# EAGLE design Adafruit RP2040 Tester Brains rev A (EAGLE 9.6.2)
COMPANY: ADAFRUIT INDUSTRIES; DRAWN: KTOWN; REV: B
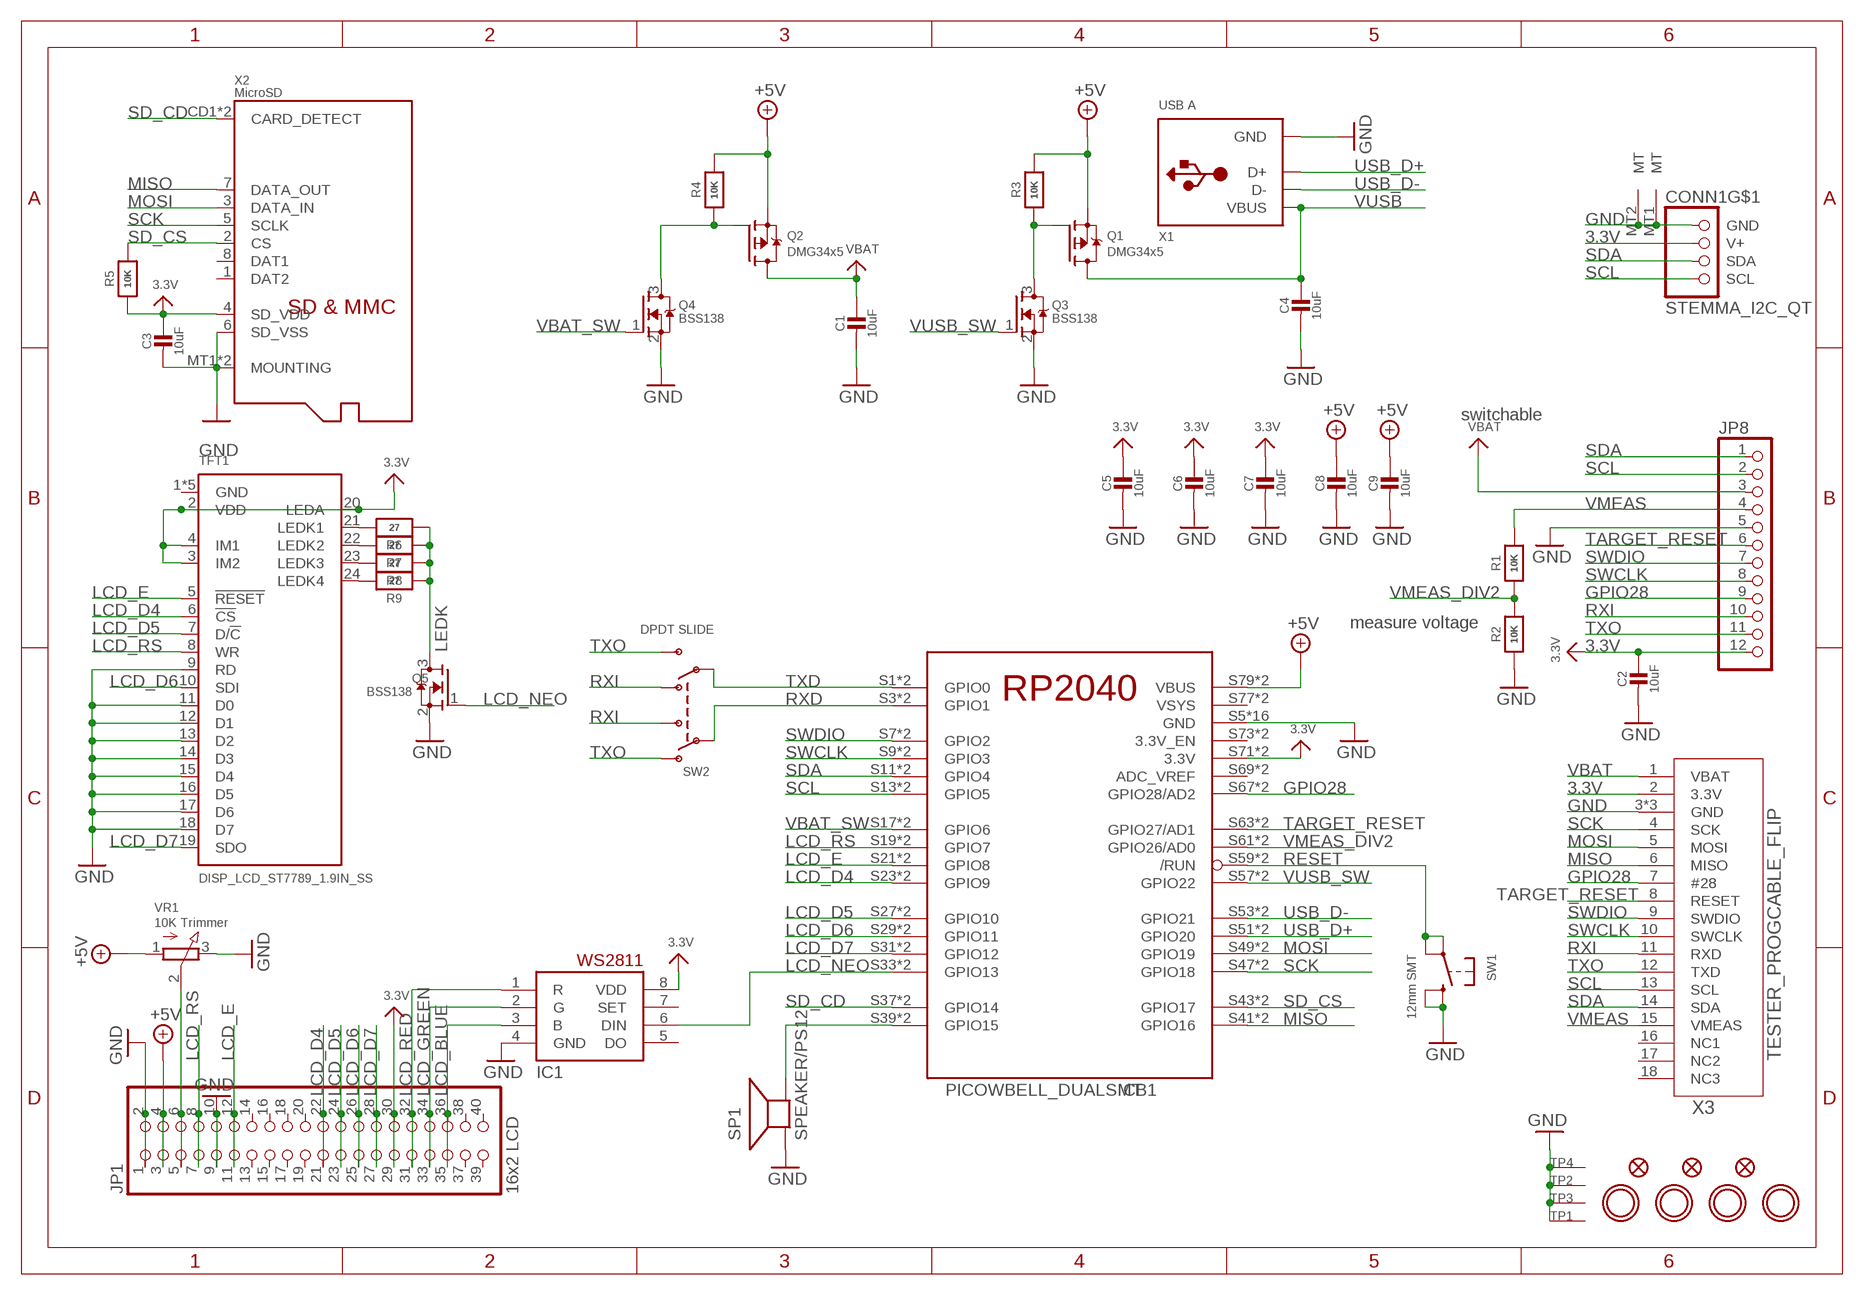
[diagram p0: schematic, sheet 1]

## Parts
C1  10uF  CAP_CERAMIC0805-NOOUTLINE  [0805-NO]
C2  10uF  CAP_CERAMIC0805-NOOUTLINE  [0805-NO]
C3  10uF  CAP_CERAMIC0805-NOOUTLINE  [0805-NO]
C4  10uF  CAP_CERAMIC0805-NOOUTLINE  [0805-NO]
C5  10uF  CAP_CERAMIC0805-NOOUTLINE  [0805-NO]
C6  10uF  CAP_CERAMIC0805-NOOUTLINE  [0805-NO]
C7  10uF  CAP_CERAMIC0805-NOOUTLINE  [0805-NO]
C8  10uF  CAP_CERAMIC0805-NOOUTLINE  [0805-NO]
C9  10uF  CAP_CERAMIC0805-NOOUTLINE  [0805-NO]
CB1  PICOWBELL_DUALSMT  [PICOWBELL_DUALSMT]
CONN1  STEMMA_I2C_QT  [JST_SH4]
FID1  FIDUCIAL_1MM  [FIDUCIAL_1MM]
FID2  FIDUCIAL_1MM  [FIDUCIAL_1MM]
FID3  FIDUCIAL_1MM  [FIDUCIAL_1MM]
IC1  WS2811-SOP8  [SO08-SKINNYPADS]
JP1  16x2 LCD  PINHD-2X20_SMT  [2X20_SMT_MALE]
JP8  HEADER-1X12OVAL  [1X12_OVAL]
Q1  DMG34x5  MOSFET-PWIDE  [SOT23-WIDE]
Q2  DMG34x5  MOSFET-PWIDE  [SOT23-WIDE]
Q3  BSS138  MOSFET-NWIDE  [SOT23-WIDE]
Q4  BSS138  MOSFET-NWIDE  [SOT23-WIDE]
Q5  BSS138  MOSFET-NWIDE  [SOT23-WIDE]
R1  10K  RESISTOR_0603_NOOUT  [0603-NO]
R2  10K  RESISTOR_0603_NOOUT  [0603-NO]
R3  10K  RESISTOR_0603_NOOUT  [0603-NO]
R4  10K  RESISTOR_0603_NOOUT  [0603-NO]
R5  10K  RESISTOR_0603_NOOUT  [0603-NO]
R6  27  RESISTOR_0603_NOOUT  [0603-NO]
R7  27  RESISTOR_0603_NOOUT  [0603-NO]
R8  27  RESISTOR_0603_NOOUT  [0603-NO]
R9  27  RESISTOR_0603_NOOUT  [0603-NO]
SP1  SPEAKER/PS12  [PS12]
SW1  12mm SMT  SWITCH_TACT_SMT_12MM  [B3F-40XX-SMT]
SW2  DPDT SLIDE  SWITCH_DPDTEG1390  [EG1390]
TFT1  DISP_LCD_ST7789_1.9IN_SS  [TFT_1.9IN_170X320_30P_SS]
TP1  SEWTAP_SMTNUTM3  [SMT_NUT_3MM]
TP2  SEWTAP_SMTNUTM3  [SMT_NUT_3MM]
TP3  SEWTAP_SMTNUTM3  [SMT_NUT_3MM]
TP4  SEWTAP_SMTNUTM3  [SMT_NUT_3MM]
U$7  MOUNTINGHOLE3.0THIN  [MOUNTINGHOLE_3.0_PLATEDTHIN]
U$8  MOUNTINGHOLE3.0THIN  [MOUNTINGHOLE_3.0_PLATEDTHIN]
U$9  MOUNTINGHOLE3.0THIN  [MOUNTINGHOLE_3.0_PLATEDTHIN]
U$10  MOUNTINGHOLE3.0THIN  [MOUNTINGHOLE_3.0_PLATEDTHIN]
VR1  10K Trimmer  TRIMPOTTC33X-2  [TRIMPOT_BOURNS_TC33X-2]
X1  USB A  USB_TYPEA_SMT  [USB_HOST-SMT]
X2  MicroSD  MICROSD  [MICROSD]
X3  TESTER_PROGCABLE_FLIP  [FPC_0.5MM_18PIN]

## Nets
3.3V: C2.1 C3.1 C5.1 C6.1 C7.1 CB1.S71(3.3V) CB1.S72(3.3V) CONN1.2(V+) IC1.8(VDD) JP1.29 JP1.30 JP8.12 R5.1 TFT1.2(VDD) TFT1.3(IM2) TFT1.4(IM1) TFT1.20(LEDA) X2.4(SD_VDD) X3.2(3.3V)
!VBAT_SW1: Q2.1(G) Q4.3(D) R4.1
!VBAT_SW2: Q1.1(G) Q3.3(D) R3.1
+5V: C8.1 C9.1 CB1.S79(VBUS) CB1.S80(VBUS) JP1.3 JP1.4 Q1.2(S) Q2.2(S) R3.2 R4.2 VR1.1(A)
GND: C1.2 C2.2 C3.2 C4.2 C5.2 C6.2 C7.2 C8.2 C9.2 CB1.S5(GND) CB1.S6(GND) CB1.S15(GND) CB1.S16(GND) CB1.S25(GND) CB1.S26(GND) CB1.S35(GND) CB1.S36(GND) CB1.S45(GND) CB1.S46(GND) CB1.S55(GND) CB1.S56(GND) CB1.S65(GND) CB1.S66(GND) CB1.S75(GND) CB1.S76(GND) CONN1.1(GND) CONN1.MT1(MT) CONN1.MT2(MT) IC1.4(GND) JP1.1 JP1.2 JP1.9 JP1.10 JP8.5 Q3.2(S) Q4.2(S) Q5.2(S) R2.1 SP1.P$1(+) SW1.P$3(S) SW1.P$4(S1) TFT1.9(RD) TFT1.11(D0) TFT1.12(D1) TFT1.13(D2) TFT1.14(D3) TFT1.15(D4) TFT1.16(D5) TFT1.17(D6) TFT1.18(D7) TP1.P$1(SEW) TP2.P$1(SEW) TP3.P$1(SEW) TP4.P$1(SEW) VR1.3(E) X1.GND X2.6(SD_VSS) X2.MT1(MOUNTING) X2.MT2(MOUNTING) X3.3(GND) X3.SUPPORT1(GND) X3.SUPPORT2(GND)
GPIO28: CB1.S67(GPIO28/AD2) CB1.S68(GPIO28/AD2) JP8.9 X3.7(#28)
LCD_BLUE: IC1.3(B) JP1.35 JP1.36
LCD_D4: CB1.S23(GPIO9) CB1.S24(GPIO9) JP1.21 JP1.22 TFT1.6(!CS)
LCD_D5: CB1.S27(GPIO10) CB1.S28(GPIO10) JP1.23 JP1.24 TFT1.7(D/!C)
LCD_D6: CB1.S29(GPIO11) CB1.S30(GPIO11) JP1.25 JP1.26 TFT1.10(SDI)
LCD_D7: CB1.S31(GPIO12) CB1.S32(GPIO12) JP1.27 JP1.28 TFT1.19(SDO)
LCD_E: CB1.S21(GPIO8) CB1.S22(GPIO8) JP1.11 JP1.12 TFT1.5(!RESET)
LCD_GREEN: IC1.2(G) JP1.33 JP1.34
LCD_NEO: CB1.S33(GPIO13) CB1.S34(GPIO13) IC1.6(DIN) Q5.1(G)
LCD_RED: IC1.1(R) JP1.31 JP1.32
LCD_RS: CB1.S19(GPIO7) CB1.S20(GPIO7) JP1.7 JP1.8 TFT1.8(WR)
LEDK: Q5.3(D) R6.1 R7.1 R8.1 R9.1
MISO: CB1.S41(GPIO16) CB1.S42(GPIO16) X2.7(DATA_OUT) X3.6(MISO)
MOSI: CB1.S49(GPIO19) CB1.S50(GPIO19) X2.3(DATA_IN) X3.5(MOSI)
N$1: CB1.S39(GPIO15) CB1.S40(GPIO15) SP1.P$2(-)
N$2: R6.2 TFT1.21(LEDK1)
N$3: R7.2 TFT1.22(LEDK2)
N$4: R8.2 TFT1.23(LEDK3)
N$5: R9.2 TFT1.24(LEDK4)
N$6: JP1.5 JP1.6 VR1.2(S)
RESET: CB1.S59(/RUN) CB1.S60(/RUN) SW1.P$1(P) SW1.P$2(P1)
RXD: CB1.S3(GPIO1) CB1.S4(GPIO1) SW2.P1
RXI: JP8.10 SW2.O2 SW2.S1 X3.11(RXD)
SCK: CB1.S47(GPIO18) CB1.S48(GPIO18) X2.5(SCLK) X3.4(SCK)
SCL: CB1.S13(GPIO5) CB1.S14(GPIO5) CONN1.4(SCL) JP8.2 X3.13(SCL)
SD_CD: CB1.S37(GPIO14) CB1.S38(GPIO14) X2.CD1(CARD_DETECT) X2.CD2(CARD_DETECT)
SD_CS: CB1.S43(GPIO17) CB1.S44(GPIO17) R5.2 X2.2(CS)
SDA: CB1.S11(GPIO4) CB1.S12(GPIO4) CONN1.3(SDA) JP8.1 X3.14(SDA)
SWCLK: CB1.S9(GPIO3) CB1.S10(GPIO3) JP8.8 X3.10(SWCLK)
SWDIO: CB1.S7(GPIO2) CB1.S8(GPIO2) JP8.7 X3.9(SWDIO)
TARGET_RESET: CB1.S63(GPIO27/AD1) CB1.S64(GPIO27/AD1) JP8.6 X3.8(RESET)
TXD: CB1.S1(GPIO0) CB1.S2(GPIO0) SW2.P2
TXO: JP8.11 SW2.O1 SW2.S2 X3.12(TXD)
USB_D+: CB1.S51(GPIO20) CB1.S52(GPIO20) X1.D+
USB_D-: CB1.S53(GPIO21) CB1.S54(GPIO21) X1.D-
VBAT: C1.1 JP8.3 Q2.3(D) X3.1(VBAT)
VBAT_SW: CB1.S17(GPIO6) CB1.S18(GPIO6) Q4.1(G)
VMEAS: JP8.4 R1.2 X3.15(VMEAS)
VMEAS_DIV2: CB1.S61(GPIO26/AD0) CB1.S62(GPIO26/AD0) R1.1 R2.2
VUSB: C4.1 Q1.3(D) X1.VBUS
VUSB_SW: CB1.S57(GPIO22) CB1.S58(GPIO22) Q3.1(G)
Unconnected: CB1.S69(ADC_VREF) CB1.S70(ADC_VREF) CB1.S73(3.3V_EN) CB1.S74(3.3V_EN) IC1.5(DO) IC1.7(SET) JP1.13 JP1.14 JP1.15 JP1.16 JP1.17 JP1.18 JP1.19 JP1.20 JP1.37 JP1.38 JP1.39 JP1.40 X2.1(DAT2) X2.8(DAT1) X3.16(NC1) X3.17(NC2) X3.18(NC3)

## Notes on the sheet
- switchable
- measure voltage

## Power pins joined to a net without a drawn wire
GND: TFT1.1(GND) TFT1.25(GND) TFT1.30(GND) TFT1.MNT1(GND) TFT1.MNT2(GND)
VSYS: CB1.S77(VSYS) CB1.S78(VSYS)

## Library data of the parts
C1-C9 = microbuilder:CAP_CERAMIC: Ceramic Capacitors For new designs, use the packages preceded by an '_' character since they are more reliable: The following footprints should be used on most boards: _0402 - Standard footprint for regular board layouts _0603 - Standard footprint for regular board layouts _0805 - Standard footprint for regular board layouts _1206 - Standard footprint for regular board layouts For extremely tight-pitch boards where space is at a premium, the following 'micro-pitch' footprints can be used (smaller pads, no silkscreen outline, etc.): _0402MP - Micro-pitch footprint for very dense/compact boards _0603MP - Micro-pitch footprint for very dense/compact boards _0805MP - Micro-pitch footprint for very dense/compact boards _1206MP - Micro-pitch footprint for very dense/compact boards
CB1 = adafruit_micro:PICOWBELL
CONN1 = adafruit_electromech:STEMMA_I2C; LCSC: C2845363
FID1-FID3 = microbuilder:FIDUCIAL: Fiducial Alignment Points Various fiducial points for machine vision alignment.; BOM: EXCLUDE
IC1 = adafruit:WS2811
JP1 = adafruit_electromech:PINHD-2X20: PIN HEADER
JP8 = microbuilder:HEADER-1X12
Q1 Q2 = microbuilder:MOSFET-P: P-Channel Mosfet LEGEND VDS: Voltage Drain-Source ID: Drain Current RDS(ON): Drain-Source On-State Resistance VGS(TH): Gate-Source Threshold Voltage CISS: Drain-Source Input Capacitance SOT-23 Name VDS ID RDS(ON) VGS(TH) CISS Order Number IRLML5103 30V 760mA 600 mOhm -- 75pF @ 25V Digikey: IRLML5103PBFCT-ND IRLML6401 12V 4.3A 50 mOhm 950mV @ 250µA 830pF @ 10V Digikey: IRLML6401PBFTR-ND NTR0202PL 20V 400mA 800 mOhm 2.3V @ 250uA 70pF @ 5V Digikey: NTR0202PLT1GOSTR-ND NTR4101PT1G 20V 1.8A 85 mOhm 1.2V @ 250uA 675pF @ 10V Digikey: NTR4101PT1GOSCT-ND DMP2004K 20V 600mA 900 mOhm 1V @ 250uA 175pF @ 16V Digikey: DMP2004KDICT-ND PMV65XP 20V 3.9A 76 mOhm 950mV @ 1mA 725pF @ 20V Digikey: 568-2358-2-ND TO-252 Name VDS ID RDS(ON) VGS(TH) CISS Order Number AOD417 30V 25A 34 mOhm 3V @ 250µA 920pF @ 15V Digikey: 785-1106-2-ND PowerPak Name VDS ID RDS(ON) VGS(TH) CISS Order Number AON7401 30V 12A 14 mOhm 3V @ 250µA 2600pF @ 15V Digikey: 785-1302-1-ND
Q3-Q5 = microbuilder:MOSFET-N: N-Channel Mosfet LEGEND VDS: Voltage Drain-Source ID: Drain Current RDS(ON): Drain-Source On-State Resistance VGS(TH): Gate-Source Threshold Voltage CISS: Drain-Source Input Capacitance SOT-23 Name VDS ID RDS(ON) VGS(TH) CISS Order Number 2N7002E 60V 260mA 2.5 Ohm 2.5V @ 250uA 26.7pF @ 25V 2N7002ET1GOSTR-ND BSH103 30V 850mA 400 mOhm 400mV @ 1mA 83pF @ 24V BSH103,235-ND BSS138 60V 320mA 1.6 Ohm 1.5V @ 250uA 50pF @ 10V Mouser: 771-BSS138PW115 DMN2075U-7 20V 4.2A 38 mOhm 1V @ 250 uA 594.3pF @ 10V DMN2075U-7DICT-ND * BSS138 good choice for I2C level-shifting POWERPAK 1212-8 Name VDS ID RDS(ON) VGS(TH) CISS Order Number Si7308DN 60V 6A 58 mOhm 3V @ 250uA 665pF @ 15V SI7308DN-T1-E3CT-ND
R1-R5 = microbuilder:RESISTOR: Resistors For new designs, use the packages preceded by an '_' character since they are more reliable: The following footprints should be used on most boards: _0402 - Standard footprint for regular board layouts _0603 - Standard footprint for regular board layouts _0805 - Standard footprint for regular board layouts _1206 - Standard footprint for regular board layouts For extremely tight-pitch boards where space is at a premium, the following 'micro-pitch' footprints can be used (smaller pads, no silkscreen outline, etc.): _0402MP - Micro-pitch footprint for very dense/compact boards _0603MP - Micro-pitch footprint for very dense/compact boards _0805MP - Micro-pitch footprint for very dense/compact boards _1206MP - Micro-pitch footprint for very dense/compact boards
R6-R9 = microbuilder:RESISTOR: Resistors For new designs, use the packages preceded by an '_' character since they are more reliable: The following footprints should be used on most boards: _0402 - Standard footprint for regular board layouts _0603 - Standard footprint for regular board layouts _0805 - Standard footprint for regular board layouts _1206 - Standard footprint for regular board layouts For extremely tight-pitch boards where space is at a premium, the following 'micro-pitch' footprints can be used (smaller pads, no silkscreen outline, etc.): _0402MP - Micro-pitch footprint for very dense/compact boards _0603MP - Micro-pitch footprint for very dense/compact boards _0805MP - Micro-pitch footprint for very dense/compact boards _1206MP - Micro-pitch footprint for very dense/compact boards; LCSC: C25190
SP1 = microbuilder:SPEAKER: SPEAKER Source: Buerklin Added PS12 (for part # PS1240 piezo) http://www.ladyada.net/library/pcb/eaglelibrary.html
SW1 = adafruit_electromech:SWITCH_TACT_SMT: SMT Tact Switches 6x6mm - Digikey: P12940SCT-ND KMR2 (4.6x2.8mm) - Digikey: 401-1426-1-ND EVQ-PQHB55 - Light Touch, 160GF (4.5x4.5mm) - Digikey: P8090SCT-ND KMT0 - KMT021 NGJ LHS (etc.) IP68/Waterproof - Digikey: CKN10289CT-ND
SW2 = adafruit_electromech:SWITCH_DPDT: Switch - DPDT A DPDT Switch acts like an SPDT switch, but has a pair of switches instead of just one. Vertical - 0.3A @ 6V SMT - Digikey: JS202011SCQN; LCSC: C318999
TFT1 = adafruit_display:DISP_LCD_ST7789_1.9IN
TP1-TP4 = adafruit_electromech:SEWTAP
U$7-U$10 = adafruit_electromech:MOUNTINGHOLE: Mounting Hole For #2 screws (0.086"/2.18mm width, 0.094"/2.4mm hole) use 2.5mm; BOM: EXCLUDE
VR1 = microbuilder:TRIMPOT: 3-Pin SMT Trimpots Bourns TC33 (X-2) Series 1K - Digikey: TC33X-102ECT-ND 10K - Digikey: TC33X-2-103E 100K - Digikey: TC33X-104ECT-ND Bourns 3303 (W) Series 3mm 10K Single Turn - Digikey: 3303W-103ETR-ND 3mm 100K Single Turn - Digikey: 3303X-104ETR-ND; ROT: 270
X1 = adafruit_electromech:USB_TYPEA: USB - Type A Connectors Male types stick out and are inserted into a PC or matching females parts (these are the connectors used on USB Memory Sticks, etc.). Female parts are generally used for USB Host and accept a male-type connector. SMT - 4UCON: 10017 PTHFML - Digikey: 609-1045-ND, 4UCon: 05241 PCB - Use 2.0mm thick PCBs with this footprint
X2 = adafruit_electromech:MICROSD: MicroSD/Transflash Card Holder with SPI pinout 3M: 2908-05WB-MG 4UConnector: 19656 Footprint courtesy: Adafruit Industries; JLC_ROTATION: 90; LCSC: C125617
X3 = adafruit_electromech:TESTER_PROGCABLE; LCSC: C2856802

## Net classes
1 power: width 0.254 mm

## Board
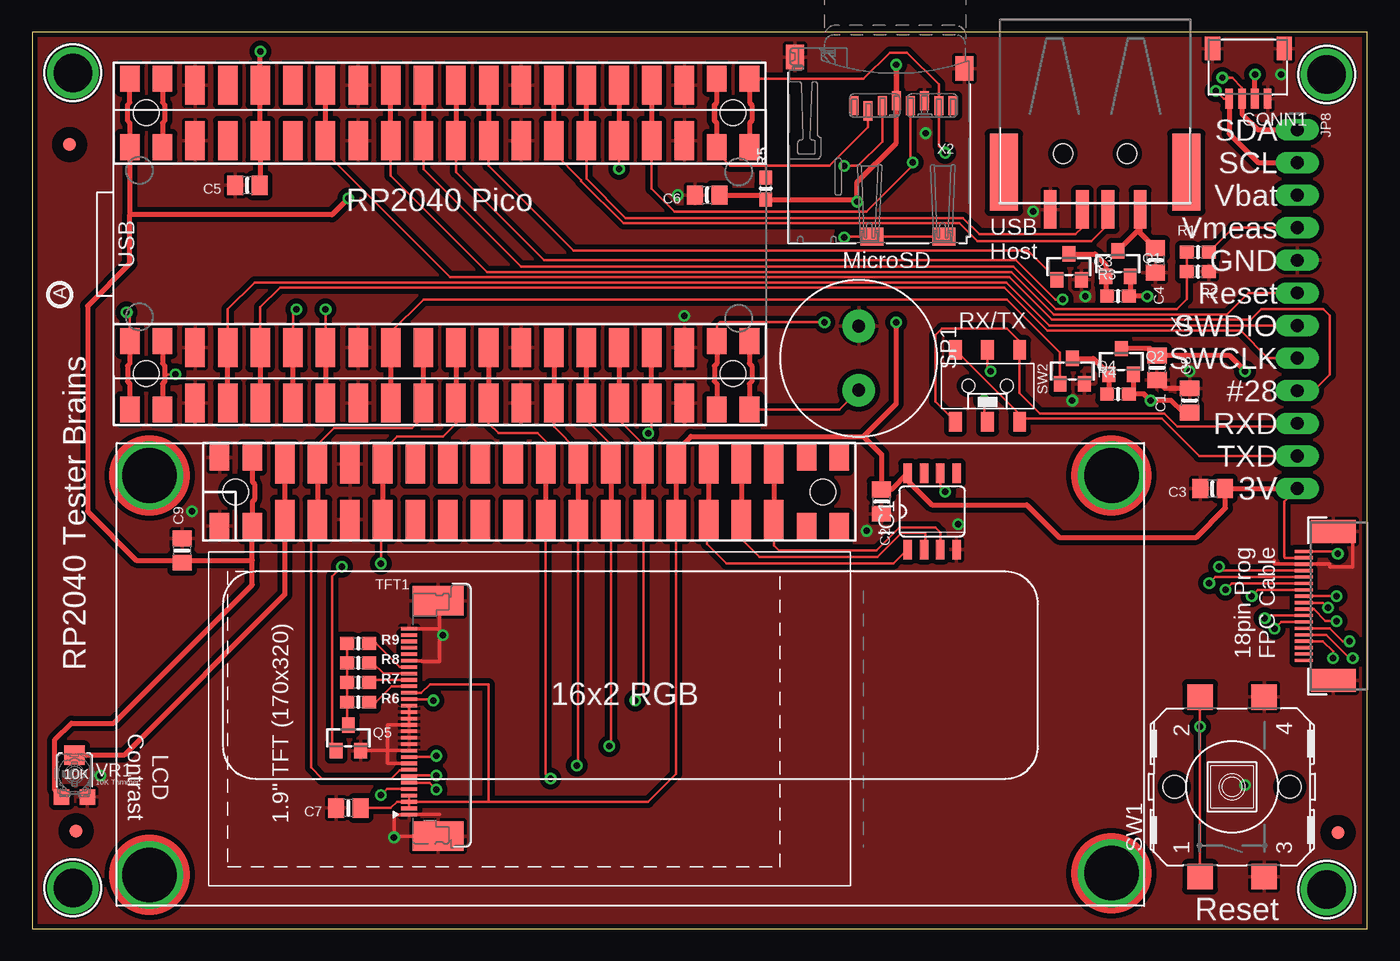
[diagram p1: board, top side]
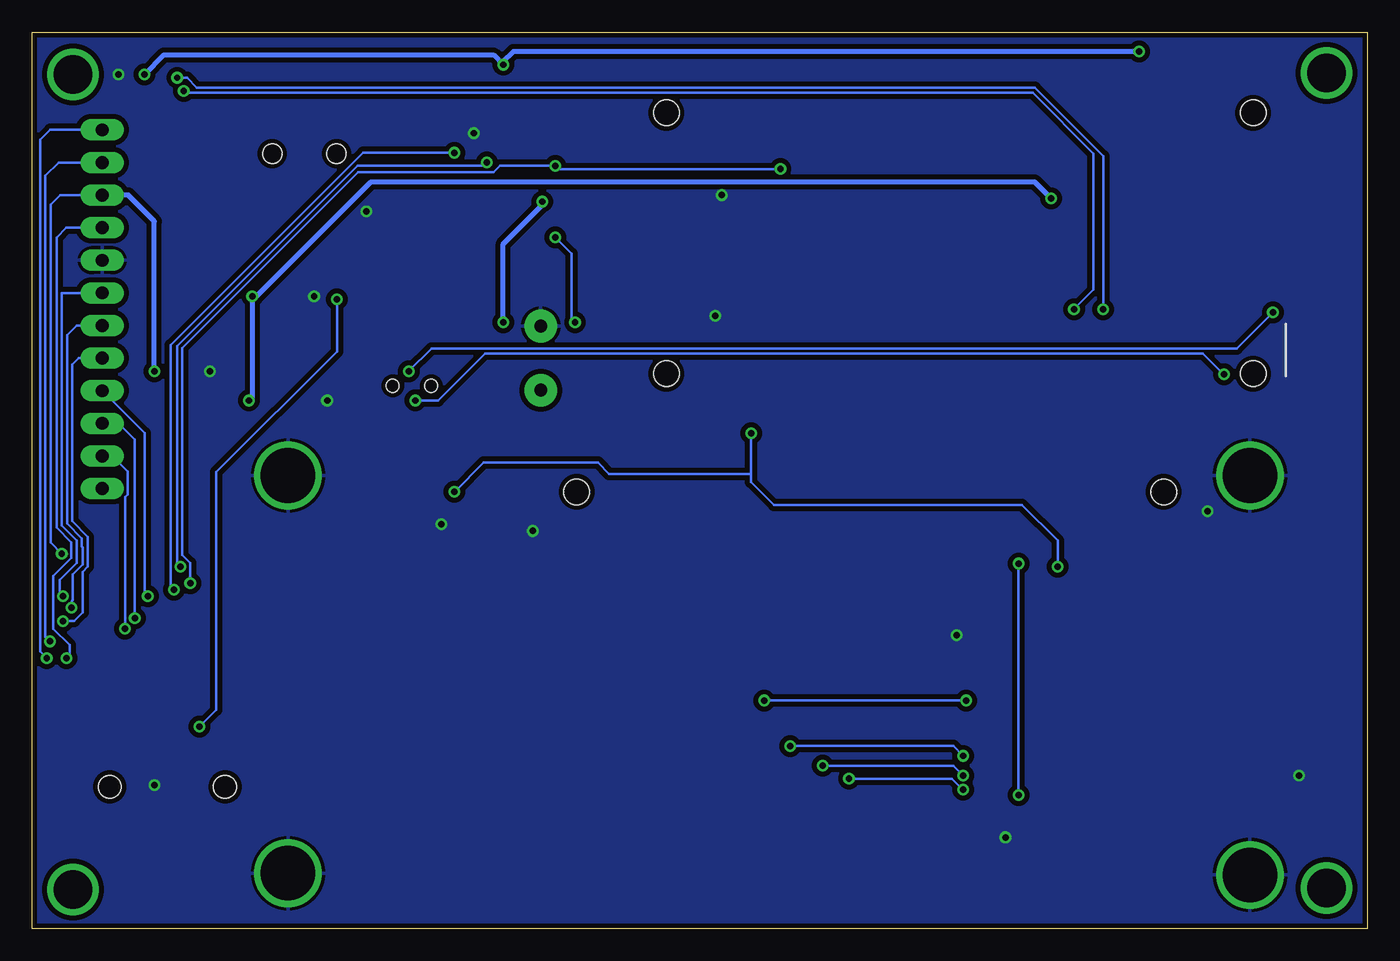
[diagram p2: board, bottom side, seen from below]

Size 104.01 x 69.85 mm. Coordinates in mm from the lower left corner, seen from the top.
Outline: 0,69.85 0,0 104.01,0 104.01,69.85 0,69.85
Copper layers (1*16): Top 0.035mm / dielectric 1.5mm / Bottom 0.035mm
Design rules "adafruit 8-8": minimum track width 6mil, minimum drill 15.5mil, track to track 8mil, track to pad 8mil, pad to pad 8mil, via to via 8mil, smd to smd 8mil, copper to edge 10mil, drill to drill 8mil, minimum pad ring 10mil, minimum via ring 8mil, stop-mask expansion 2mil, vias tented up to drill 20mil, thermal gap 10mil

### Footprints (pad centres in the part's own frame; a part is rotated, then mirrored left to right if it is on the bottom)
0805-NO = smd 1.24 x 1.5: 1 -0.95,0; 2 0.95,0
PICOWBELL_DUALSMT = smd 1.524 x 2.032: S1 -24.13,-12.889; S2 -24.13,-7.555; S3 -21.59,-12.889; S4 -21.59,-7.555; S37 21.59,-12.889; S38 21.59,-7.555; S39 24.13,-12.889; S40 24.13,-7.555; S41 24.13,12.889; S42 24.13,7.555; S43 21.59,12.889; S44 21.59,7.555; S77 -21.59,7.555; S78 -21.59,12.889; S79 -24.13,7.555; S80 -24.13,12.889 | smd 1.524 x 3.048: S5 -19.05,-12.381; S6 -19.05,-8.063; S7 -16.51,-12.381; S8 -16.51,-8.063; S9 -13.97,-12.381; S10 -13.97,-8.063; S11 -11.43,-12.381; S12 -11.43,-8.063; S13 -8.89,-12.381; S14 -8.89,-8.063; S15 -6.35,-12.381; S16 -6.35,-8.063; S17 -3.81,-12.381; S18 -3.81,-8.063; S19 -1.27,-12.381; S20 -1.27,-8.063; S21 1.27,-12.381; S22 1.27,-8.063; S23 3.81,-12.381; S24 3.81,-8.063; S25 6.35,-12.381; S26 6.35,-8.063; S27 8.89,-12.381; S28 8.89,-8.063; S29 11.43,-12.381; S30 11.43,-8.063; S31 13.97,-12.381; S32 13.97,-8.063; S33 16.51,-12.381; S34 16.51,-8.063; S35 19.05,-12.381; S36 19.05,-8.063; S45 19.05,8.063; S46 19.05,12.381; S47 16.51,8.063; S48 16.51,12.381; S49 13.97,8.063; S50 13.97,12.381; S51 11.43,8.063; S52 11.43,12.381; S53 8.89,8.063; S54 8.89,12.381; S55 6.35,8.063; S56 6.35,12.381; S57 3.81,8.063; S58 3.81,12.381; S59 1.27,8.063; S60 1.27,12.381; S61 -1.27,8.063; S62 -1.27,12.381; S63 -3.81,8.063; S64 -3.81,12.381; S65 -6.35,8.063; S66 -6.35,12.381; S67 -8.89,8.063; S68 -8.89,12.381; S69 -11.43,8.063; S70 -11.43,12.381; S71 -13.97,8.063; S72 -13.97,12.381; S73 -16.51,8.063; S74 -16.51,12.381; S75 -19.05,8.063; S76 -19.05,12.381 | hole 2: -22.86,10.222; 22.86,10.222; 22.86,-10.098; -22.86,-10.098
JST_SH4 = smd 0.6 x 1.55: 1 -1.5,2.006; 2 -0.5,2.006; 3 0.5,2.006; 4 1.5,2.006 | smd 1.2 x 1.8: MT1 -2.8,-1.894; MT2 2.8,-1.894
FIDUCIAL_1MM = smd 1 x 1: 1 0,0
SO08-SKINNYPADS = smd 0.66 x 1.524: 1 -1.905,-2.973; 2 -0.635,-2.973; 3 0.635,-2.973; 4 1.905,-2.973; 5 1.905,2.973; 6 0.635,2.973; 7 -0.635,2.973; 8 -1.905,2.973
2X20_SMT_MALE = smd 1.524 x 2.032: 1 -24.13,-2.667; 2 -24.13,2.667; 3 -21.59,-2.667; 4 -21.59,2.667; 37 21.59,-2.667; 38 21.59,2.667; 39 24.13,-2.667; 40 24.13,2.667 | smd 1.524 x 3.048: 5 -19.05,-2.159; 6 -19.05,2.159; 7 -16.51,-2.159; 8 -16.51,2.159; 9 -13.97,-2.159; 10 -13.97,2.159; 11 -11.43,-2.159; 12 -11.43,2.159; 13 -8.89,-2.159; 14 -8.89,2.159; 15 -6.35,-2.159; 16 -6.35,2.159; 17 -3.81,-2.159; 18 -3.81,2.159; 19 -1.27,-2.159; 20 -1.27,2.159; 21 1.27,-2.159; 22 1.27,2.159; 23 3.81,-2.159; 24 3.81,2.159; 25 6.35,-2.159; 26 6.35,2.159; 27 8.89,-2.159; 28 8.89,2.159; 29 11.43,-2.159; 30 11.43,2.159; 31 13.97,-2.159; 32 13.97,2.159; 33 16.51,-2.159; 34 16.51,2.159; 35 19.05,-2.159; 36 19.05,2.159 | hole 2: -22.86,0; 22.86,0
1X12_OVAL = drill 1 pad 1.676 long: 1 -13.97,0; 2 -11.43,0; 3 -8.89,0; 4 -6.35,0; 5 -3.81,0; 6 -1.27,0; 7 1.27,0; 8 3.81,0; 9 6.35,0; 10 8.89,0; 11 11.43,0; 12 13.97,0
SOT23-WIDE = smd 1 x 1.2: 1 -0.95,-1; 2 0.95,-1; 3 0,1
0603-NO = smd 1.075 x 1: 1 -0.85,0; 2 0.85,0
PS12 = drill 1 pad 2.54: P$1 -2.5,0; P$2 2.5,0
B3F-40XX-SMT = smd 2 x 2: P$1 -7,2.5; P$2 7,2.5; P$3 -7,-2.5; P$4 7,-2.5 | hole 1.803: 0,-4.496; 0,4.496
EG1390 = smd 1 x 1.5: O1 -2.5,2.8; O2 -2.5,-2.8; P1 0,2.8; P2 0,-2.8; S1 2.5,2.8; S2 2.5,-2.8 | hole 1: 1.5,0; -1.5,0
TFT_1.9IN_170X320_30P_SS = smd 0.28 x 1.25: 1 -7.25,1.236; 2 -6.75,1.236; 3 -6.25,1.236; 4 -5.75,1.236; 5 -5.25,1.236; 6 -4.75,1.236; 7 -4.25,1.236; 8 -3.75,1.236; 9 -3.25,1.236; 10 -2.75,1.236; 11 -2.25,1.236; 12 -1.75,1.236; 13 -1.25,1.236; 14 -0.75,1.236; 15 -0.25,1.236; 16 0.25,1.236; 17 0.75,1.236; 18 1.25,1.236; 19 1.75,1.236; 20 2.25,1.236; 21 2.75,1.236; 22 3.25,1.236; 23 3.75,1.236; 24 4.25,1.236; 25 4.75,1.236; 26 5.25,1.236; 27 5.75,1.236; 28 6.25,1.236; 29 6.75,1.236; 30 7.25,1.236 | smd 2.3 x 4: MNT1 -8.92,-1.02; MNT2 9.42,-1.02
SMT_NUT_3MM = drill 4.25 pad 4.572: P$1 0,0
MOUNTINGHOLE_3.0_PLATEDTHIN = drill 3 pad 3.6: P$1 0,0
TRIMPOT_BOURNS_TC33X-2 = smd 1.2 x 1.2: 1 -1,-1.8; 3 1,-1.8 | smd 1.6 x 1.5: 2 0,1.45
USB_HOST-SMT = smd 1 x 3: D+ 1,0.495; D- -1,0.495; GND 3.5,0.495; VBUS -3.5,0.495 | smd 2.2 x 6: MT1 -7.1,-2.413; MT2 7.1,-2.413 | hole 1.5: -2.5,-3.863; 2.5,-3.863
MICROSD = smd 0.7 x 1.5: 1 1.761,-3.147; 2 0.661,-2.747; 3 -0.439,-3.147; 4 -1.539,-3.547; 5 -2.639,-3.147; 6 -3.739,-3.547; 7 -4.839,-3.147; 8 -5.939,-3.147 | smd 1.8 x 1.4: CD1 -5.239,7.053; CD2 0.38,7.053 | smd 1.4 x 1.9: MT1 -6.839,-6.047; MT2 6.361,-6.947
FPC_0.5MM_18PIN = smd 0.25 x 1.4: 1 4.25,1.154; 2 3.75,1.154; 3 3.25,1.154; 4 2.75,1.154; 5 2.25,1.154; 6 1.75,1.154; 7 1.25,1.154; 8 0.75,1.154; 9 0.25,1.154; 10 -0.25,1.154; 11 -0.75,1.154; 12 -1.25,1.154; 13 -1.75,1.154; 14 -2.25,1.154; 15 -2.75,1.154; 16 -3.25,1.154; 17 -3.75,1.154; 18 -4.25,1.154 | smd 1.8 x 3.5: SUPPORT1 -5.8,-1.152; SUPPORT2 5.8,-1.152

### Placement (x,y rotation side)
C1  87.63,43.69 270 top
C2  66.17,33.27 270 top
C3  91.95,34.29 180 top
C4  87.5,52.07 270 top
C5  16.76,57.91 180 top
C6  52.58,57.15 180 top
C7  24.64,9.4 180 top
C8  90.17,41.15 90 top
C9  11.68,29.46 90 top
CB1  31.75,53.34 0 top
CONN1  94.74,66.67 180 top
FID1  3.43,7.62 0 top
FID2  2.92,61.09 0 top
FID3  101.73,7.49 0 top
IC1  70.1,32.51 0 top
JP1  38.73,34.04 0 top
JP8  98.55,48.26 270 top
Q1  84.58,51.82 0 top
Q2  84.84,44.2 0 top
Q3  80.77,51.56 0 top
Q4  81.03,43.43 0 top
Q5  24.64,14.86 0 top
R1  90.81,52.7 0 top
R2  90.81,51.18 180 top
R3  84.58,49.28 0 top
R4  84.58,41.66 0 top
R5  57.15,57.66 90 top
R6  25.4,17.65 0 top
R7  25.4,19.18 0 top
R8  25.4,20.7 0 top
R9  25.4,22.23 0 top
SP1  64.39,44.45 270 top
SW1  93.47,11.05 90 top
SW2  74.42,42.29 180 top
TFT1  30.61,16.13 90 top
TP1  9.14,4.19 0 top
TP2  9.14,35.31 0 top
TP3  84.07,35.31 0 top
TP4  84.07,4.32 0 top
U$7  100.84,66.55 0 top
U$8  3.17,66.67 0 top
U$9  3.17,3.17 0 top
U$10  100.84,3.05 0 top
U$13  [PCBFEAT-REV-040]  2.16,49.4 90 top
VR1  3.3,12.06 0 top
X1  82.8,56.52 180 top
X2  65.79,60.96 180 top
X3  100.2,25.15 90 top

### Tracks (layer width: path | path; a pad name or v marks a point on that pad's centre or on a via)
3.3V  (via drill 0.5)
  Top 0.203: JP1.29 50.16,12.06 47.98,9.88 35.56,9.88 | 35.56,9.88 29.42,9.88 29.37,9.94 TFT1.4 TFT1.3 | TFT1.3 29.46,9.88 29.37,9.97 | TFT1.3 TFT1.2 | TFT1.20 30.32,18.38 30.99,19.05 35.56,19.05 35.56,9.88 | X3.2 97.6,28.9 97.54,28.96 97.54,33.27 JP8.12 | TFT1.3 28.42,9.88 27.94,9.4 C7.1
  Top 0.406: CONN1.2 v95.24,66.54 v95.25,66.55 | X2.4 67.31,64.52 v67.31,67.31 67.31,61.21 64.26,58.17 v64.26,56.64 64.26,56.81 R5.1 56.81,57.15 C6.1 | JP1.29 JP1.30 50.16,37.21 51.31,38.35 64.77,38.35 | 64.77,38.35 66.17,36.96 C2.1 66.94,34.22 IC1.8 68.2,34.92 70.1,33.02 77.47,33.02 80.01,30.48 90.68,30.48 92.96,32.77 92.96,34.29 | C3.1 92.96,34.29 | 92.96,34.29 JP8.12 | v17.78,68.33 CB1.S72 CB1.S71 17.78,57.98 C5.1 | v17.78,68.33 | 64.77,38.35 67.31,40.89 v67.31,47.24
  Bottom 0.406: v95.25,66.55 93.73,68.07 68.07,68.07 v67.31,67.31 67.31,67.56 66.55,68.33 v17.78,68.33 | v67.31,47.24 67.31,53.34 64.26,56.39 v64.26,56.64
!VBAT_SW1
  Top 0.406: R4.1 83.89,41.81 Q2.1 82.65,44.43 Q4.3
!VBAT_SW2
  Top 0.406: R3.1 83.63,49.38 Q1.1 83.63,51.75 82.82,52.56 Q3.3
+5V  (via drill 0.5)
  Top 0.406: CB1.S80 7.62,64.35 7.43,64.17 7.43,62.96 7.62,62.77 CB1.S79 7.62,55.63 | Q1.2 85.53,49.38 R3.2 v86.87,49.28 | Q2.2 85.79,42.01 R4.2 86.61,41.66 v87.12,41.15 88.71,41.15 89.66,40.2 C8.1 | JP1.4 17.14,34.83 17.33,34.64 17.33,33.43 17.14,33.24 JP1.3 17.14,28.7 | VR1.1 1.78,10.79 1.78,14.73 3.05,16 6.35,16 17.14,26.8 17.14,28.7 | 7.62,55.63 7.62,51.82 4.32,48.51 4.32,32.51 8.13,28.7 11.36,28.7 | 11.36,28.7 17.14,28.7 | v24.64,56.9 23.37,55.63 7.62,55.63 | C9.1 11.36,28.7
  Bottom 0.406: v24.64,56.9 25.91,58.17 77.63,58.17 86.52,49.28 v86.87,49.28 86.87,41.4 v87.12,41.15
GND  (via drill 0.5)
  Top 0.203: TFT1.18 TFT1.17 TFT1.16 TFT1.15
  Top 0.254: TFT1.11 27.69,13.88 | 27.69,13.88 25.59,13.88 Q5.2 | TFT1.9 27.69,12.88 27.69,13.88 | TFT1.15 27.69,15.88 27.69,13.88 | TFT1.30 29.37,23.37 31.75,23.37 | 31.75,23.37 31.75,25.55 TFT1.MNT2 | TFT1.25 29.37,20.85 30.33,20.85 30.33,20.83 31.75,20.83 31.75,23.37 | 96.77,28.7 96.77,28.4 X3.3 101.09,28.4 101.09,28.19 102.87,28.19 102.87,30.95 X3.SUPPORT2 | TFT1.MNT1 28.19,7.21 28.19,8.89 28.45,8.89 28.45,8.88 TFT1.1 31.75,8.89
  Top 0.406: C8.2 88.27,42.1 C1.2
  other vias: 69.6,61.98 50.29,57.15 77.98,55.88 82.04,49.28 97.28,66.55 72.14,31.5 65.02,30.99 32,22.86 28.19,7.11 12.45,32.51 94.49,11.18 5.33,11.94 50.8,47.75 81.03,41.15 90.17,43.43
  pour Top (isolate 0.381): 0,69.85 0,0 104.14,0 104.14,69.85
  pour Bottom (isolate 0.381): 0,69.85 0,0 104.14,0 104.14,69.85
GPIO28  (via drill 0.5)
  Top 0.203: CB1.S67 22.86,60.46 32.58,50.75 76.12,50.75 79.42,47.45 94.94,47.45 95.76,48.26 100.58,48.26 101.09,47.75 101.09,43.18 99.82,41.91 JP8.9 | v95,25.91 95.49,26.4 X3.7
  Top 0.406: CB1.S67 CB1.S68
  Bottom 0.203: JP8.9 95.25,38.61 95.25,26.15 v95,25.91
LCD_BLUE
  Top 0.203: JP1.35 57.78,29.84 58.17,29.46 65.79,29.46 67.56,31.24 70.36,31.24 70.74,30.86 IC1.3
  Top 0.406: JP1.36 JP1.35
LCD_D4  (via drill 0.5)
  Top 0.203: CB1.S23 35.56,39.37 36.32,38.61 39.37,38.61 40.13,37.85 40.13,35.56 40.01,35.69 JP1.22 | JP1.21 40.01,12.06 v40.39,11.68 | v31.5,10.83 30.95,11.38 TFT1.6
  Top 0.406: CB1.S24 CB1.S23 | JP1.22 JP1.21
  Bottom 0.203: v40.39,11.68 32.35,11.68 v31.5,10.83
LCD_D5  (via drill 0.5)
  Top 0.203: CB1.S27 40.64,39.12 42.55,37.21 JP1.24 | JP1.23 42.55,12.83 v42.42,12.7 | v31.5,11.94 30.13,11.94 30.12,11.93 29.93,11.93 TFT1.7
  Top 0.406: CB1.S28 CB1.S27 | JP1.24 JP1.23
  Bottom 0.203: v42.42,12.7 32.26,12.7 v31.5,11.94
LCD_D6  (via drill 0.5)
  Top 0.203: CB1.S29 43.18,39.62 45.09,37.72 JP1.26 | JP1.25 45.09,14.35 v44.96,14.22 | v31.5,13.46 31.41,13.38 TFT1.10
  Top 0.406: CB1.S29 | CB1.S30 | CB1.S29 CB1.S30 | JP1.26 JP1.25
  Bottom 0.203: v44.96,14.22 32.26,14.22 v31.5,13.46
LCD_D7  (via drill 0.5)
  Top 0.203: CB1.S31 45.72,39.62 47.62,37.72 JP1.28 | JP1.27 47.62,18.41 v46.99,17.78 | v31.24,17.78 31.14,17.88 TFT1.19
  Top 0.406: CB1.S32 CB1.S31 | JP1.28 JP1.27
  Bottom 0.203: v46.99,17.78 v31.24,17.78
LCD_E  (via drill 0.5)
  Top 0.203: CB1.S21 33.02,39.37 32,38.35 28.45,38.35 27.18,37.08 27.18,36.32 JP1.12 | TFT1.5 27.64,10.88 v27.18,10.41 | v27.18,28.45 27.18,31.75 JP1.11
  Top 0.406: CB1.S22 CB1.S21 | JP1.12 JP1.11
  Bottom 0.203: v27.18,10.41 v27.18,28.45
LCD_GREEN
  Top 0.203: JP1.33 55.24,30.35 56.64,28.96 65.85,28.96 67.73,30.84 69.49,30.84 69.6,30.73 69.6,29.67 IC1.2
  Top 0.406: JP1.34 JP1.33
LCD_NEO  (via drill 0.5)
  Top 0.203: Q5.1 23.37,14.18 23.37,27.43 v24.13,28.19 | v48.01,38.61 48.26,38.86 48.26,41.66 | v71.12,34.04 70.74,34.42 IC1.6
  Top 0.406: CB1.S33 48.26,41.66 CB1.S34
  Bottom 0.203: v24.13,28.19 24.13,30.23 26.92,33.02 46.23,33.02 48.01,34.8 48.01,35.43 | v48.01,38.61 48.01,35.43 | v71.12,34.04 68.83,36.32 59.94,36.32 59.05,35.43 48.01,35.43
LCD_RED
  Top 0.203: IC1.1 67.11,28.45 54.1,28.45 52.58,29.97 52.58,31.75 JP1.31
  Top 0.406: JP1.32 JP1.31
LCD_RS
  Top 0.203: CB1.S19 30.48,39.88 29.62,39.01 23.52,39.01 22.23,37.72 JP1.8 | JP1.7 21.72,31.37 21.72,12.57 22.61,11.68 27.98,11.68 28.64,12.34 29.84,12.34 TFT1.8
  Top 0.406: CB1.S19 CB1.S20 | JP1.8 JP1.7
LEDK
  Top 0.203: R9.1 R8.1 R7.1 R6.1 24.55,15.95 Q5.3
MISO  (via drill 0.5)
  Top 0.203: CB1.S41 64.77,66.23 66.8,68.26 68.14,68.26 70.62,65.77 X2.7 70.62,60.95 v71.12,60.45 | v92.96,26.42 93.44,26.9 X3.6
  Top 0.406: CB1.S41 55.88,64.35 56.07,64.17 56.07,62.96 55.88,62.77 CB1.S42
  Bottom 0.203: v71.12,60.45 78.23,60.45 93.22,45.47 93.22,26.67 v92.96,26.42
MOSI  (via drill 0.5)
  Top 0.203: X2.3 66.22,61.31 64.35,59.44 v63.25,59.44 | v45.72,59.18 CB1.S49 | X3.5 92.17,27.4 v91.69,26.92
  Top 0.406: CB1.S50 CB1.S49
  Bottom 0.203: v45.72,59.18 62.99,59.18 v63.25,59.44 67.56,59.44 68.07,58.93 78.61,58.93 92.3,45.23 92.3,29.11 91.7,28.51 91.7,26.93 v91.69,26.92
N$1
  Top 0.203: CB1.S39 62.89,40.45 SP1.P$2
  Top 0.406: CB1.S40 55.88,44.03 56.07,43.84 56.07,42.64 55.88,42.45 CB1.S39
N$2
  Top 0.203: TFT1.21 28.02,18.88 26.8,17.65 R6.2
N$3
  Top 0.203: TFT1.22 26.45,19.38 R7.2
N$4
  Top 0.203: TFT1.23 27.36,19.88 26.54,20.7 R8.2
N$5
  Top 0.203: TFT1.24 28.64,20.38 26.8,22.23 R9.2
N$6
  Top 0.406: JP1.6 JP1.5 19.68,26.04 7.17,13.52 VR1.2
RESET  (via drill 0.5)
  Top 0.203: SW1.P$1 v90.97,15.75 SW1.P$2 | CB1.S59 33.02,58.93 39.88,52.07 76.65,52.07 79.7,49.02 v80.26,49.02
  Top 0.406: CB1.S60 CB1.S59
  Bottom 0.203: v80.26,49.02 80.26,44.96 89.66,35.56 89.66,17.06 v90.97,15.75
RXD  (via drill 0.5)
  Top 0.203: v74.17,41.15 74.17,39.74 SW2.P1 | v11.18,43.18 10.35,43.18
  Top 0.406: CB1.S4 10.16,44.03 10.35,43.84 10.35,43.18 10.35,42.64 10.16,42.45 CB1.S3
  Bottom 0.203: v74.17,41.15 72.39,41.15 68.73,44.81 12.8,44.81 v11.18,43.18
RXI  (via drill 0.5)
  Top 0.203: JP8.10 98.3,39.12 89.22,39.12 88.19,40.15 78.49,40.15 76.92,41.72 SW2.O2 76.92,45.76 75.95,46.74 70.87,46.74 70.36,46.23 70.36,41.05 SW2.S1 | X3.11 96.23,24.4 v96.02,24.18
  Bottom 0.203: v96.02,24.18 96.02,38.1 97.28,39.37 JP8.10
SCK  (via drill 0.5)
  Top 0.203: CB1.S47 48.26,57.66 50.04,55.88 65,55.88 68.65,59.53 68.58,59.6 v68.58,59.69 68.75,59.69 68.42,60.01 X2.5 | v92.46,28.19 92.76,27.9 X3.4
  Top 0.406: CB1.S48 CB1.S47
  Bottom 0.203: v68.58,59.69 68.83,59.44 78.67,59.44 92.71,45.4 92.71,28.44 v92.46,28.19
SCL  (via drill 0.5)
  Top 0.203: v102.62,22.38 102.11,22.38 101.1,23.4 X3.13 | CONN1.4 92.81,64.67 v92.2,65.28 | v22.86,48.26 | v22.86,48.26 CB1.S14
  Top 0.406: CB1.S14 CB1.S13 | CONN1.4 93.24,61.95 95.5,59.69 JP8.2
  Bottom 0.203: JP8.2 101.96,59.69 102.97,58.67 102.97,22.74 v102.62,22.38 | v22.86,48.26 21.34,49.78 21.34,60.38 26.08,65.13 92.05,65.13 v92.2,65.28
SD_CD  (via drill 0.5)
  Top 0.203: X2.CD1 X2.CD2 63.3,53.91 v63.25,53.85 | v61.72,47.24 53.59,47.24 53.34,46.99 CB1.S38
  Top 0.406: CB1.S38 53.34,44.03 53.15,43.84 53.15,42.64 53.34,42.45 CB1.S37
  Bottom 0.203: v63.25,53.85 61.98,52.58 61.98,47.24 v61.72,47.24
SD_CS
  Top 0.203: CB1.S43 53.34,64.21 53.26,64.12 53.26,60.54 54.36,59.44 57.15,59.44 | X2.2 65.12,62.44 62.12,59.44 57.15,59.44 | 57.15,59.44 R5.2
  Top 0.406: CB1.S44 53.34,62.77 53.15,62.96 53.15,64.17 53.34,64.35 CB1.S43
SDA  (via drill 0.5)
  Top 0.203: v102.87,21.08 102.62,21.08 100.8,22.9 X3.14 | CB1.S12 20.32,48.01 v20.57,48.26 | v92.71,66.29 93.47,66.29 94.23,65.53 CONN1.3
  Top 0.406: CB1.S11 CB1.S12 | CONN1.3 94.24,63.49 95.5,62.23 JP8.1
  Bottom 0.203: JP8.1 102.62,62.23 103.38,61.47 103.38,21.59 v102.87,21.08 | v20.57,48.26 20.57,60.2 25.91,65.53 91.19,65.53 91.95,66.29 v92.71,66.29
SWCLK  (via drill 0.5)
  Top 0.203: v101.6,23.96 100.75,23.96 99.82,24.9 X3.10 | CB1.S10 17.78,48.41 19.3,49.94 75.73,49.94 79.08,46.58 94.13,46.58 96.27,44.45 JP8.8
  Top 0.406: CB1.S10 CB1.S9
  Bottom 0.203: JP8.8 100.38,44.45 100.89,43.94 100.89,31.75 99.67,30.53 99.67,28.21 100.08,27.81 100.08,24.64 100.75,23.96 v101.6,23.96
SWDIO  (via drill 0.5)
  Top 0.203: v100.94,25 100.55,25.4 X3.9 | JP8.7 79.25,46.99 75.89,50.34 17.32,50.34 15.24,48.26 CB1.S8
  Top 0.406: CB1.S7 CB1.S8
  Bottom 0.203: JP8.7 100.53,46.99 101.3,46.23 101.3,31.58 100.14,30.42 100.14,29.78 100.08,29.72 100.08,28.38 100.85,27.61 100.85,25.59 100.94,25.5 v100.94,25
TARGET_RESET  (via drill 0.5)
  Top 0.203: CB1.S63 27.94,58.67 35.46,51.16 76.29,51.16 79.59,47.85 93.07,47.85 94.74,49.53 JP8.6 | X3.8 99.06,25.91 v101.6,25.91
  Top 0.406: CB1.S63 CB1.S64
  Bottom 0.203: JP8.6 101.7,49.53 101.7,31.41 100.54,30.25 100.54,28.49 101.86,27.17 101.86,26.16 v101.6,25.91
TXD  (via drill 0.5)
  Top 0.203: SW2.P2 74.42,43.69 v74.68,43.43 | v7.37,48.01 7.62,47.75 7.62,45.47
  Top 0.406: CB1.S2 7.62,45.47 7.62,44.03 7.43,43.84 7.43,42.64 7.62,42.45 CB1.S1
  Bottom 0.203: v74.68,43.43 72.9,45.21 10.16,45.21 v7.37,48.01
TXO  (via drill 0.5)
  Top 0.203: SW2.S2 76.92,40.08 SW2.O1 77.18,39.74 88.02,39.74 90.93,36.83 JP8.11 | v96.77,23.37 97.3,23.9 X3.12
  Bottom 0.203: JP8.11 97.79,36.83 96.57,35.61 96.57,33.82 96.77,33.61 v96.77,23.37
USB_D+
  Top 0.203: CB1.S52 43.18,58.42 46.23,55.37 72.52,55.37 73.79,54.1 81.28,54.1 81.8,54.62 X1.D+
  Top 0.406: CB1.S51 CB1.S52
USB_D-
  Top 0.203: X1.D- 83.8,54.85 82.53,53.57 73.62,53.57 72.22,54.97 46.06,54.97 42.77,58.25 42.77,58.32 40.64,60.45 40.64,61.72
  Top 0.406: CB1.S53 40.64,61.72 CB1.S54
VBAT  (via drill 0.5)
  Top 0.203: v101.71,29.21 101.52,29.4 X3.1
  Top 0.406: Q2.3 87.07,45.2 C1.1 93.28,44.64 v94.49,43.43
  Bottom 0.203: JP8.3 99.31,57.15 101.8,57.15 102.56,56.39 102.56,30.07 v101.71,29.21
  Bottom 0.406: v94.49,43.43 94.49,55.12 96.52,57.15 99.31,57.15
VBAT_SW
  Top 0.203: CB1.S18 27.94,46.48 30.48,49.02 75.95,49.02 80.08,44.89 Q4.1
  Top 0.406: CB1.S18 CB1.S17
VMEAS  (via drill 0.5)
  Top 0.203: JP8.4 93.56,54.61 R1.2 | v101.35,21.08 101.35,21.59 100.54,22.4 X3.15
  Bottom 0.203: JP8.4 101.35,54.61 102.11,53.85 102.11,31.24 100.95,30.08 100.95,28.9 102.36,27.48 102.36,23.37 101.09,22.1 101.09,21.34 v101.35,21.08
VMEAS_DIV2
  Top 0.203: R1.1 R2.2 89.95,49.06 89.15,48.26 79.76,48.26 76.45,51.56 38.1,51.56 30.48,59.18 CB1.S61
  Top 0.406: CB1.S62 CB1.S61
VSYS
  Top 0.406: CB1.S78 10.16,64.35 10.35,64.17 10.35,62.96 10.16,62.77 CB1.S77
VUSB
  Top 0.406: C4.1 86.3,54.22 X1.VBUS 86.3,54.54 Q1.3
VUSB_SW
  Top 0.203: CB1.S57 35.56,59.44 42.16,52.83 77.55,52.83 Q3.1
  Top 0.406: CB1.S58 CB1.S57

### Text on the board
tPlace: SDA | SCL | RP2040 Pico | Vbat | Vmeas | USB / Host | MicroSD | GND | Reset | RX/TX | SWDIO | SWCLK | #28 | RXD | TXD | 3V | RP2040 Tester Brains | 18pin Prog / FPC Cable | 16x2 RGB | 10K | LCD / Contrast | Reset